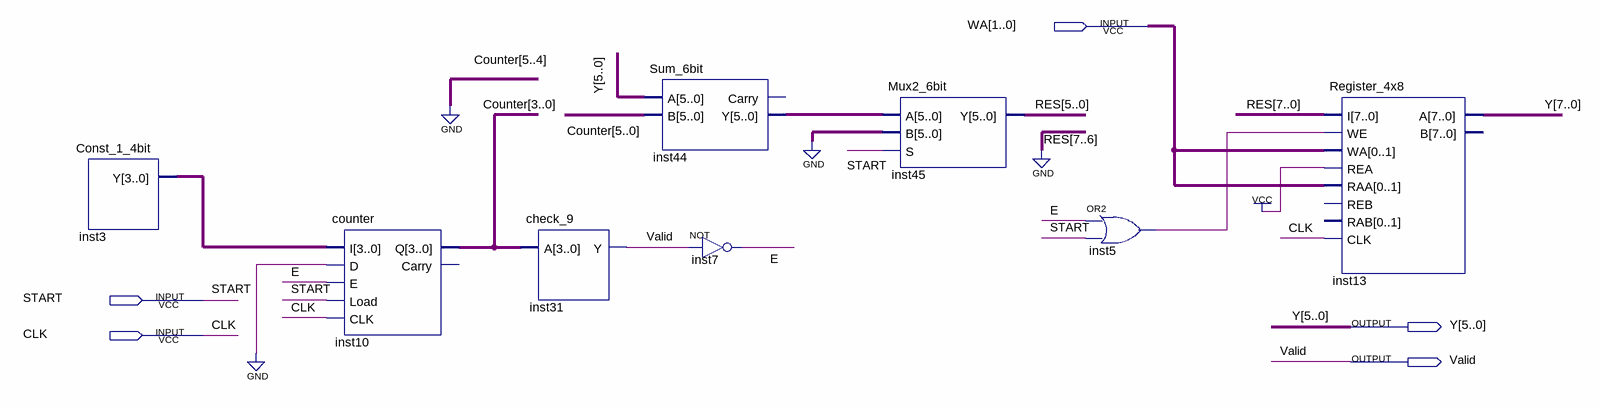
[diagram p0: schematic sheet]
// Quartus schematic Datapath.bdf as structural Verilog: 8 symbols, 5 pins
module Datapath (
  input  [1:0] WA,
  input  START,
  input  CLK,
  output [7:0] Y,
  output Valid
);

  wire E, inst5_out;
  wire [3:0] Counter, inst3_y;
  wire [5:0] inst44_y, RES;

  Const_1_4bit inst3 (.Y(inst3_y));
  counter inst10 (.I(inst3_y), .D(1'b0), .E(E), .Load(START), .CLK(CLK), .Q(Counter));  // open: Carry
  check_9 inst31 (.A(Counter), .Y(Valid));
  Sum_6bit inst44 (.A(Y[5:0]), .B({2'b00, Counter}), .Y(inst44_y));  // open: Carry
  not inst7 (E, Valid);
  Mux2_6bit inst45 (.A(inst44_y), .B({6{1'b0}}), .S(START), .Y(RES));
  or inst5 (inst5_out, E, START);
  Register_4x8 inst13 (
    .I({2'b00, RES}), .WE(inst5_out), .WA(WA), .REA(1'b1), .RAA(WA), .CLK(CLK), .A(Y));  // open: REB, RAB, B
endmodule
